# Altium schematic sheet part5.SCHDOC
size 420 x 297 mm; SheetNumber: 1; SheetTotal: 1; DocumentName: Sheet1.SCHDOC
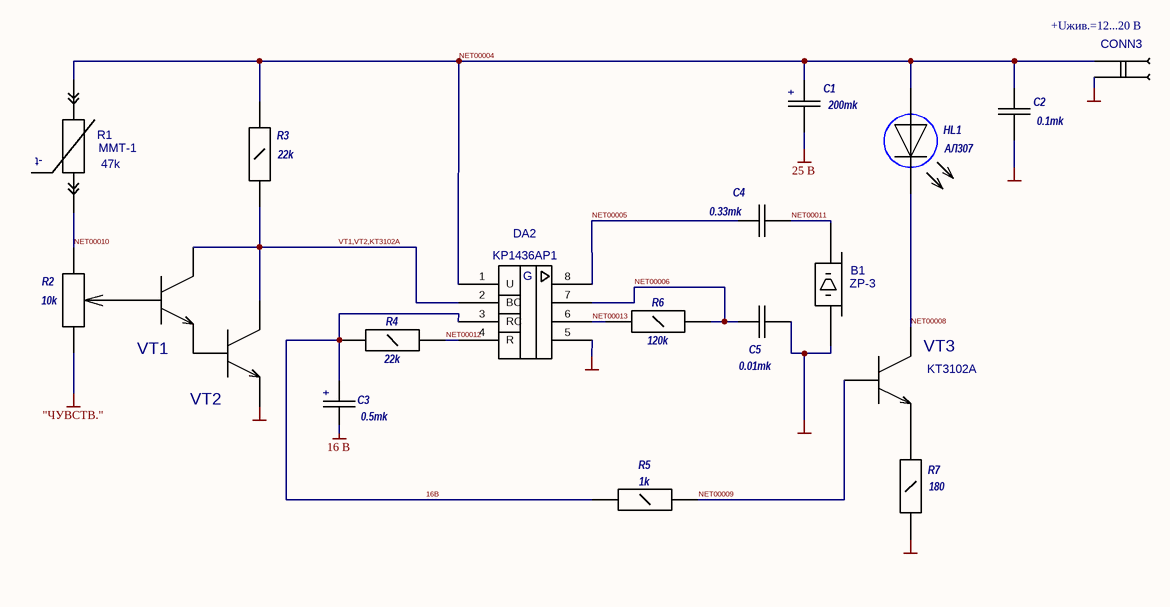
[diagram p0: part5.SCHDOC]

## Parts
B1  ZP-3  [ЗП-3]
C1  value 200mk  [К50-29 (17Х6)]  (hidden comment: K50-29 (1;2,2;4,7;10;22 MK))
C2  value 0.1mk  [K71-6 (10X4)]  (hidden comment: K71-6 (5-30 МК))
C3  value 0.5mk  [К50-29 (17Х6)]  (hidden comment: K50-29 (1;2,2;4,7;10;22 MK))
C4  value 0.33mk  [K71-6 (10X4)]  (hidden comment: K71-6 (5-30 МК))
C5  value 0.01mk  [K71-6 (10X4)]  (hidden comment: K71-6 (5-30 МК))
CONN3  value +Uжив.=12...20 В  [CONN2X]  (hidden comment: CONN2X)
DA2  KP1436AP1  [КР1436АП1]
HL1  АЛ307  [АЛ307]
R1  MMT-1  value 47k  [MMT-1]
R2  value 10k  [СП3-38В]  (hidden comment: СП3-38В)
R3  value 22k  [МЛТ(0.25)]  (hidden comment: МЛТ(0.25))
R4  value 22k  [МЛТ(0.25)]  (hidden comment: МЛТ(0.25))
R5  value 1k  [МЛТ(0.25)]  (hidden comment: МЛТ(0.25))
R6  value 120k  [МЛТ(0.25)]  (hidden comment: МЛТ(0.25))
R7  value 180  [МЛТ(0.25)]  (hidden comment: МЛТ(0.25))
VT1  KT3102A  [KT3102A]  (value not drawn)
VT2  KT3102A  [KT3102A]  (value not drawn)
VT3  KT3102A  [KT3102A]

## Nets
16 В: C3.1
25 В: C1.1
"ЧУВСТВ.": R2.2
NetB1_2: B1.2 C2.1 C5.1 CONN3.2 DA2.5 R7.2 VT2.1(E)
16B: C3.2 DA2.3(RC) R4.1 R5.1
NET00004: C1.2 C2.2 CONN3.1 DA2.1(U) HL1.1 R1.2 R3.1
NET00005: C4.2 DA2.8
NET00006: C5.2 DA2.7 R6.2
NET00008: HL1.2 VT3.3(K)
NET00009: R5.2 VT3.2(B)
NET00010: R1.1 R2.1
NET00011: B1.1 C4.1
NET00012: DA2.4(R) R4.2
NET00013: DA2.6 R6.1
VT1,VT2,KT3102A: DA2.2(BC) R3.2 VT1.3(K) VT2.3(K)
NetR2_3: R2.3 VT1.2(B)
NetR7_1: R7.1 VT3.1(E)
NetVT1_1: VT1.1(E) VT2.2(B)

## Notes on the sheet
- (in symbol K50-29 (1;2,2;4,7;10;22 MK)) +
- (in symbol KP1436AP1) G
- (in symbol MMT-1) -t

## Library data of the parts
B1 = ZP-3: Value: *
DA2 = KP1436AP1: Value: *
VT1-VT3 = KT3102A: Value: *